# EAGLE design wesleyremote (EAGLE 7.6.0)
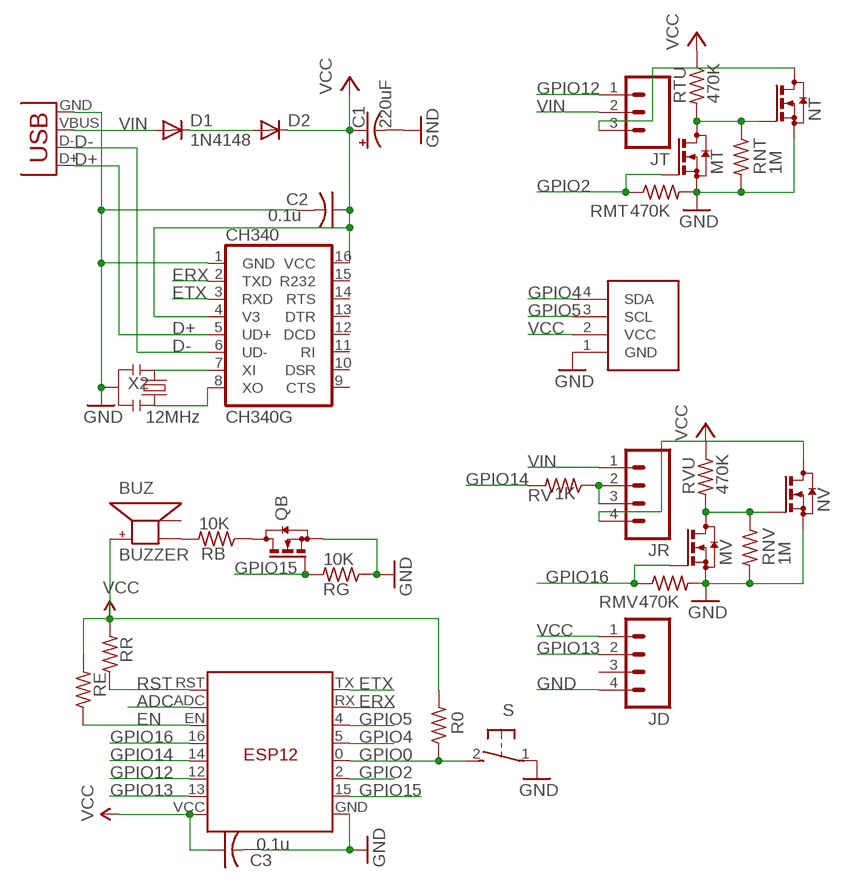
[diagram p0: schematic, sheet 1]

## Parts
BUZ  BUZZER  [SMT-8585-BUZZER]
C1  220uF  CAP_POL3528-KIT  [EIA3528-KIT]
C2  0.1u  C-USC0603K  [C0603K]
C3  0.1u  C-USC0603K  [C0603K]
CH340  CH340G  [SO16]
D1  1N4148  DIODE-MINIMELF  [MINIMELF]
D2  DIODE-MINIMELF  [MINIMELF]
ESP12  ESP12ESPWES  [ESP12_WES]
JD  M04DHT  [1X04_DHT_RFRX]
JR  M04RFRX  [1X04_RFRX]
JT  M03RFTX  [1X03_RFTX]
MT  AO3400  BSS123  [SOT23]
MV  AO3400  BSS123  [SOT23]
NT  AO3400  BSS123  [SOT23]
NV  AO3400  BSS123  [SOT23]
QB  AO3400  BSS123  [SOT23]
R0  R-US_R0603  [R0603]
RB  10K  R-US_R0603  [R0603]
RE  R-US_R0603  [R0603]
RG  10K  R-US_R0603  [R0603]
RMT  470K  R-US_R0603  [R0603]
RMV  470K  R-US_R0603  [R0603]
RNT  1M  R-US_R0603  [R0603]
RNV  1M  R-US_R0603  [R0603]
RR  R-US_R0603  [R0603]
RTU  470K  R-US_R0603  [R0603]
RV  1K  R-US_R0603  [R0603]
RVU  470K  R-US_R0603  [R0603]
S  31-XX  [B3F-31XX]
U$1  SSD1306_OLED_I2C  [SSD1306_OLED_I2C]
X2  12MHz  RESONATORSMD  [RESONATOR-SMD]
X3  USBMICROB2  [USB-MICROB2]

## Nets
ADC: ESP12.ADC
D+: CH340.5(UD+) X3.D+
D-: CH340.6(UD-) X3.D-
EN: ESP12.EN RE.1
ERX: CH340.2(TXD) ESP12.RX
ETX: CH340.3(RXD) ESP12.TX
GND: C1.C(-) C2.2 C3.2 CH340.1(GND) ESP12.GND JD.4 MT.2(S) MV.2(S) NT.2(S) NV.2(S) QB.2(S) RG.1 RMT.2 RMV.2 RNT.2 RNV.2 S.1(P) U$1.1(GND) X2.2 X3.GND
GPIO0: ESP12.0(G0) R0.1 S.2(S)
GPIO2: ESP12.2(G2) MT.1(G) RMT.1
GPIO4: ESP12.5(G5) U$1.4(SDA)
GPIO5: ESP12.4(G4) U$1.3(SCL)
GPIO12: ESP12.12(G12) JT.1
GPIO13: ESP12.13(G13) JD.2
GPIO14: ESP12.14(G14) RV.2
GPIO15: ESP12.15(G15) QB.1(G) RG.2
GPIO16: ESP12.16(G16) MV.1(G) RMV.1
N$1: BUZ.- RB.2
N$2: MV.3(D) NV.1(G) RNV.1 RVU.2
N$3: MT.3(D) NT.1(G) RNT.1 RTU.2
N$4: JT.3 NT.3(D)
N$5: D1.C D2.A
N$6: JR.2 JR.3 RV.1
N$7: JR.4 NV.3(D)
N$8: QB.3(D) RB.1
N$11: CH340.7(XI) X2.1
N$13: CH340.8(XO) X2.3
RST: ESP12.RST RR.1
VCC: BUZ.+ C1.A(+) C2.1 C3.1 CH340.4(V3) CH340.16(VCC) D2.C ESP12.VCC JD.1 R0.2 RE.2 RR.2 RTU.1 RVU.1 U$1.2(VCC)
VIN [power]: D1.A JR.1 JT.2 X3.VBUS
Unconnected: BUZ.A- CH340.9(CTS) CH340.10(DSR) CH340.11(RI) CH340.12(DCD) CH340.13(DTR) CH340.14(RTS) CH340.15(R232) JD.3

## Library data of the parts
BUZ = adafruit:BUZZER
C1 = SparkFunNew:CAP_POL: Capacitor Polarized These are standard SMD and PTH capacitors. Normally 10uF, 47uF, and 100uF in electrolytic and tantalum varieties. Always verify the external diameter of the through hole cap, it varies with capacity, voltage, and manufacturer. The EIA devices should be standard.
C2 C3 = adafruit:C-US: CAPACITOR, American symbol
CH340 = SparkFunNew:CH340
D1 D2 = diode:DIODE-: DIODE
ESP12 = JeeParts:ESP12
JD JR = SparkFun:M04: Header 4 Standard 4-pin 0.1" header. Use with straight break away headers (SKU : PRT-00116), right angle break away headers (PRT-00553), swiss pins (PRT-00743), machine pins (PRT-00117), and female headers (PRT-00115). Molex polarized connector foot print use with SKU : PRT-08231 with associated crimp pins and housings.
JT = SparkFun:M03: Header 3 Standard 3-pin 0.1" header. Use with straight break away headers (SKU : PRT-00116), right angle break away headers (PRT-00553), swiss pins (PRT-00743), machine pins (PRT-00117), and female headers (PRT-00115). Molex polarized connector foot print use with SKU : PRT-08232 with associated crimp pins and housings.
MT MV NT NV QB = transistor-small-signal:BSS123: N-CHANNEL MOS FET
R0 RE RMT RMV RNT RNV RR RTU RV RVU = adafruit:R-US_: RESISTOR, American symbol
RB RG = adafruit2013:R-US_: RESISTOR, American symbol
S = adafruit:31-XX: OMRON SWITCH Now with beefier pads!
U$1 = adafruit2013:SSD1306_OLED_I2C
X2 = SparkFunNew:RESONATOR: Resonator Small SMD resonator. This is the itty bitty 10/20MHz resonators with built in caps. CSTCE10M0G55 and CSTCE20M0V53. Footprint has been reviewed closely but hasn't been tested yet.
X3 = SparkFunNew:USB: USB Connectors USB-B-PTH is fully proven SKU : PRT-00139 USB-miniB is fully proven SKU : PRT-00587 USB-A-PCB is untested. USB-A-H is throughly reviewed, but untested. Spark Fun Electronics SKU : PRT-00437 USB-B-SMT is throughly reviewed, but untested. Needs silkscreen touching up. USB-A-S has not been used/tested USB-MB-H has not been used/tested

## Net classes
0 default: width 0.178 mm, clearance 0.178 mm
1 power: width 0.203 mm, clearance 0.178 mm

## Board
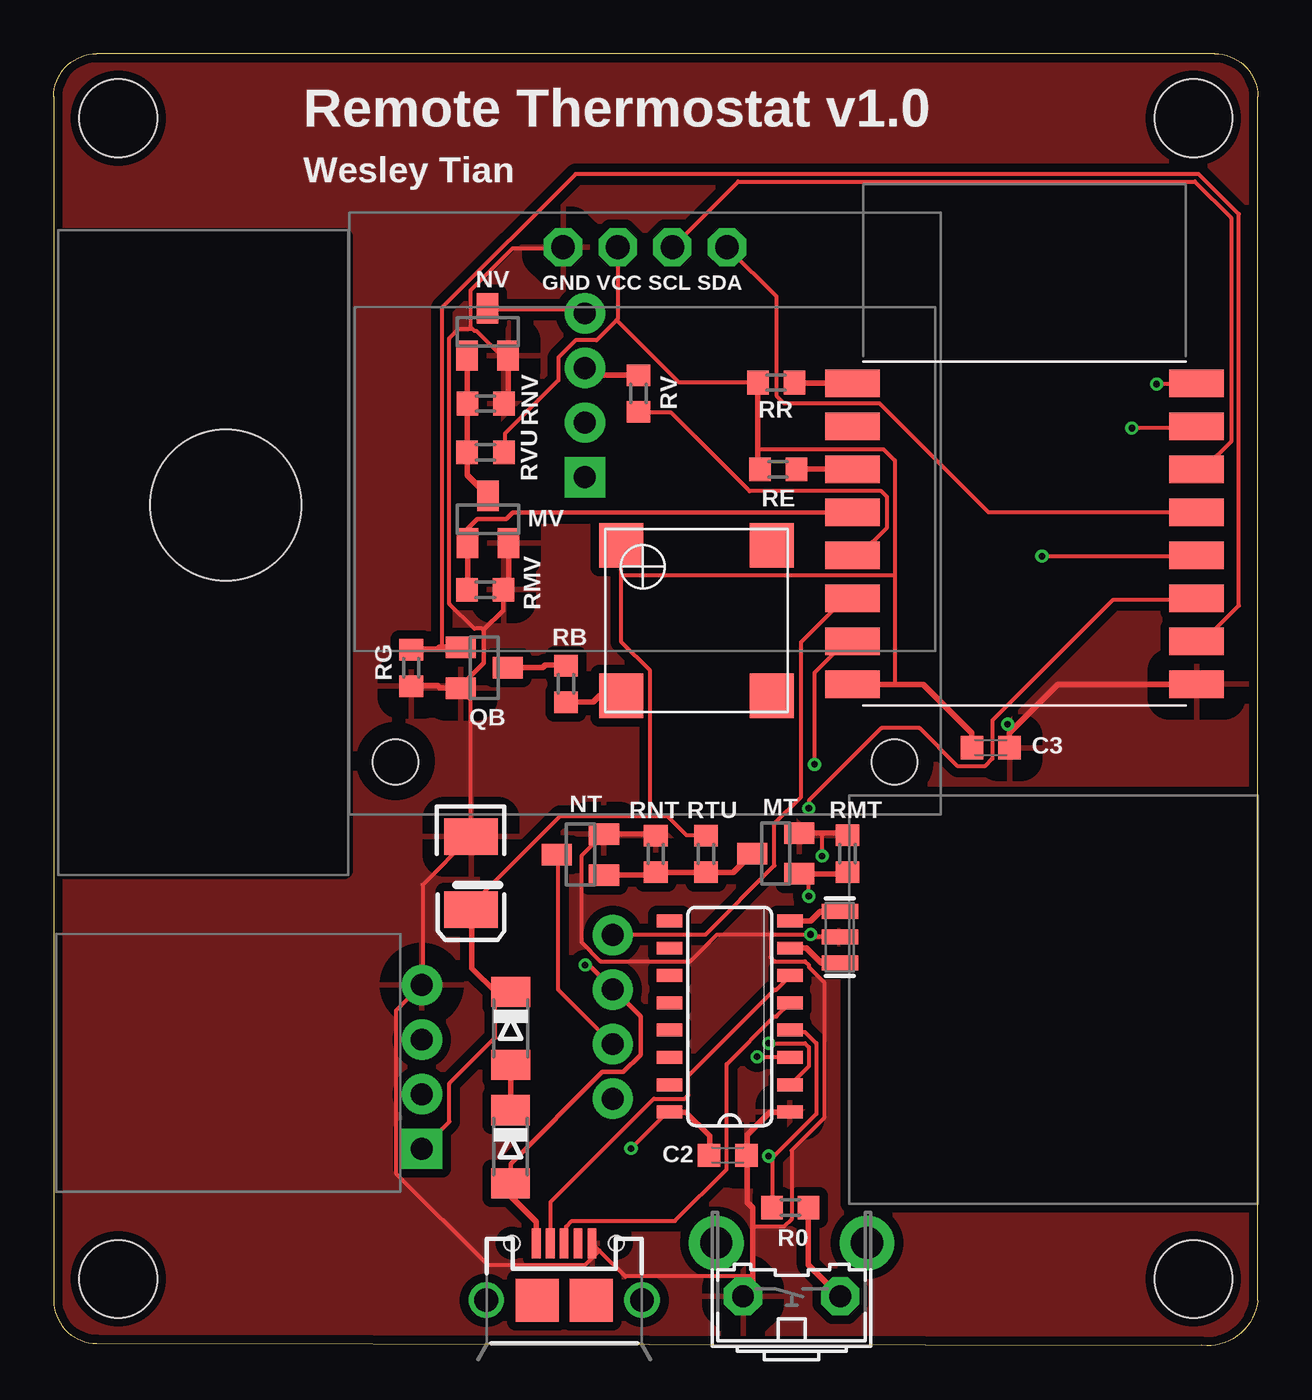
[diagram p1: board, top side]
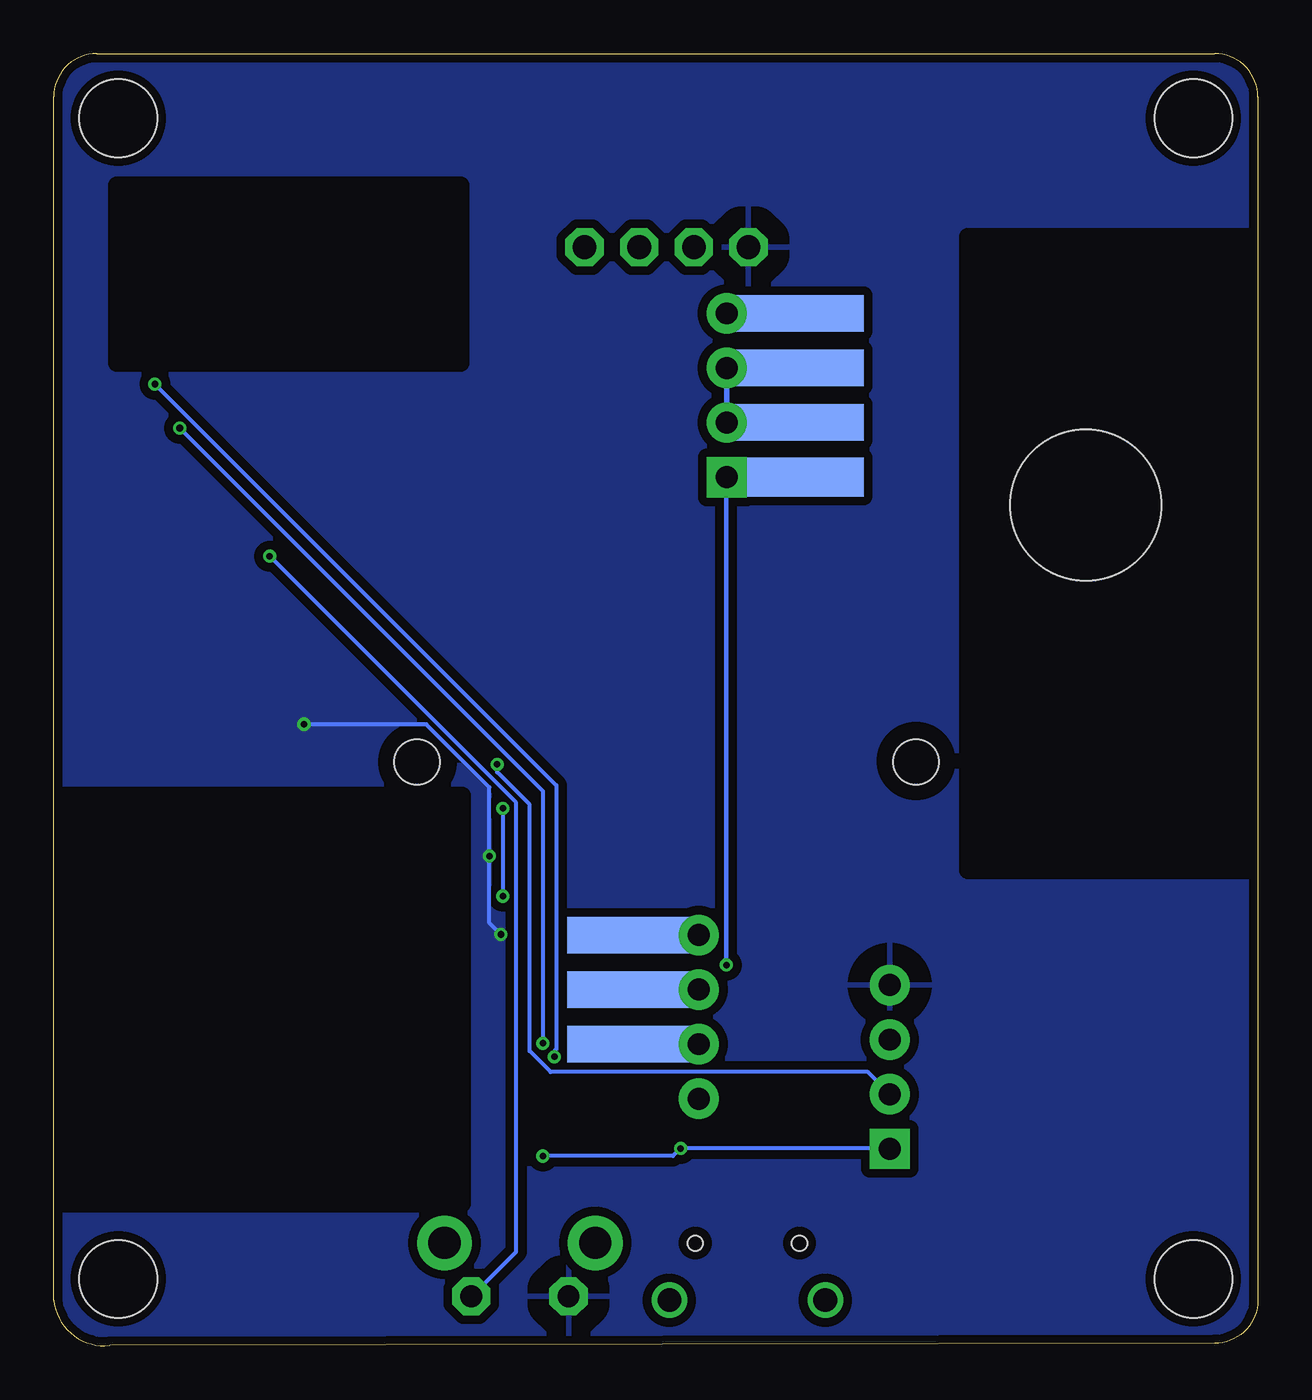
[diagram p2: board, bottom side, seen from below]

Size 56 x 60.11 mm. Coordinates in mm from the lower left corner, seen from the top.
Outline: 0,58.11 0,2.11 arc90 2,0.11 53.4,0.01 arc90 56,2.11 56,58.11 arc90 54,60.11 2,60.11 arc90 0,58.11
Copper layers (1*16): Top 0.035mm / dielectric 1.5mm / Bottom 0.035mm
Design rules "Fusion_eagle_rule_v1.1 *": minimum track width 6mil, minimum drill 12mil, track to track 6mil, track to pad 6mil, pad to pad 6mil, via to via 6mil, smd to smd 0mil, copper to edge 10mil, drill to drill 10mil, minimum pad ring 10mil, minimum via ring 6mil, stop-mask expansion 2mil, vias tented up to drill 100mil, thermal gap 40mil
Holes 3.6 mm at 3,57.11 53,57.11 3,3.11 53,3.11
Holes 7 mm at 8,39.11
tRestrict: area 0.5,22.1 to 13.5,51.6; area 37,6.6 to 56,25.6; area 14.5,25.8 to 17.3,28.6; area 37.7,25.7 to 40.5,28.6; area 37,45.8 to 53.1,54
bRestrict: area 0.5,22.1 to 13.5,51.6; area 37,6.6 to 56,25.6; area 14.5,25.8 to 17.3,28.6; area 37.7,25.7 to 40.5,28.6; area 37.1,45.7 to 53.1,54

### Footprints (pad centres in the part's own frame; a part is rotated, then mirrored left to right if it is on the bottom)
SMT-8585-BUZZER = smd 2.05 x 2.05: + -3.5,-3.5; - 3.5,-3.5; A- 3.5,3.5; NC1 -3.5,3.5
EIA3528-KIT = smd 1.7 x 2.5: A 1.7,0; C -1.7,0
C0603K = smd 1.05 x 1.08: 1 -0.875,0; 2 0.875,0
SO16 = smd 0.6 x 1.2: 1 -4.445,-2.8; 2 -3.175,-2.8; 3 -1.905,-2.8; 4 -0.635,-2.8; 5 0.635,-2.8; 6 1.905,-2.8; 7 3.175,-2.8; 8 4.445,-2.8; 9 4.445,2.8; 10 3.175,2.8; 11 1.905,2.8; 12 0.635,2.8; 13 -0.635,2.8; 14 -1.905,2.8; 15 -3.175,2.8; 16 -4.445,2.8
MINIMELF = smd 1.4 x 1.8: A 1.7,0; C -1.7,0
ESP12_WES = smd 2.54 x 1.27: 0 8,-3.27; 2 8,-5.27; 4 8,0.73; 5 8,-1.27; 12 -8,-5.27; 13 -8,-7.27; 14 -8,-3.27; 15 8,-7.27; 16 -8,-1.27; ADC -8,2.73; EN -8,0.73; GND 8,-9.27; RST -8,4.73; RX 8,2.73; TX 8,4.73; VCC -8,-9.27
1X04_DHT_RFRX = drill 1.016 pad 1.88 square: 1 0,0 | drill 1.016 pad 1.88: 2 2.54,0; 3 5.08,0; 4 7.62,0
1X04_RFRX = drill 1.016 pad 1.88 square: 1 0,0 | drill 1.016 pad 1.88: 2 2.54,0; 3 5.08,0; 4 7.62,0 | smd 1.8 x 6 bottom: P$1 0,3.38 | smd 1.7 x 6 bottom: P$2 2.54,3.38; P$3 5.08,3.38; P$4 7.62,3.38
1X03_RFTX = drill 1.016 pad 1.88: 1 0.5,-12; 2 3.04,-12; 3 5.58,-12; 4 8.12,-12 | smd 1.7 x 6 bottom: P$1 0.5,-8.89; P$2 3.04,-8.89; P$3 5.58,-8.89
SOT23 = smd 1 x 1.4: 1 -0.95,-1.1; 2 0.95,-1.1; 3 0,1.1
R0603 = smd 1 x 1.1: 1 -0.85,0; 2 0.85,0
B3F-31XX = drill 1.016 pad 1.778 octagon: 1 -2.261,-1.245; 2 2.261,-1.245 | drill 1.499 pad 2.54: 3 -3.505,1.245; 4 3.505,1.245
SSD1306_OLED_I2C = drill 1.1 pad 1.778 octagon: 1 -3.81,0; 2 -1.27,0; 3 1.27,0; 4 3.81,0 | hole 2.1: 11.6,-23.95; -11.6,-23.95
RESONATOR-SMD = smd 0.7 x 1.7: 1 -1.2,0; 2 0,0; 3 1.2,0
USB-MICROB2 = smd 0.4 x 1.4: D+ 0,2.65; D- -0.65,2.65; GND 1.3,2.65; ID 0.65,2.65; VBUS -1.3,2.65 | drill 1.1: MT1 -3.625,0; MT2 3.625,0 | smd 2 x 2: MT3 1.25,0; MT4 -1.25,0 | hole 0.7: -2.425,2.65; 2.425,2.65

### Placement (x,y rotation side)
BUZ  29.89,33.74 270 top
C1  19.41,21.99 270 top
C2  31.35,8.86 0 top
C3  43.58,27.82 0 top
CH340  31.44,15.32 90 top
D1  21.24,9.26 270 top
D2  21.25,14.77 270 top
ESP12  45.15,40.05 0 top
JD  17.12,9.16 90 top
JR  24.7,40.41 90 top
JT  38,19.61 270 top
MT  33.58,22.9 90 top
MV  20.2,38.44 0 top
NT  24.49,22.85 90 top
NV  20.18,47.16 0 top
QB  20.02,31.54 270 top
R0  34.26,6.42 180 top
RB  23.82,30.79 270 top
RE  33.69,40.78 180 top
RG  16.63,31.54 90 top
RMT  36.91,22.89 90 top
RMV  20.07,35.17 0 top
RNT  28,22.88 90 top
RNV  20.09,43.83 0 top
RR  33.6,44.81 180 top
RTU  30.34,22.88 270 top
RV  27.2,44.3 270 top
RVU  20.08,41.56 180 top
S  34.32,3.54 0 top
U$1  27.5,51.11 0 top
X2  36.56,19.01 90 top
X3  23.74,2.12 0 top

### Tracks (layer width: path | path; a pad name or v marks a point on that pad's centre or on a via)
D+
  Top 0.178: CH340.5 34.23,15.94 33.6,15.32 33.52,15.32 31.29,13.09 31.29,8.2 28.89,5.8 24.09,5.8 23.82,5.54 23.82,4.83 X3.D+
D-
  Top 0.178: CH340.6 34.23,17.18 33.6,16.56 33.52,16.56 29.52,12.56 29.52,11.67 29.34,11.49 27.91,11.49 23.11,6.69 23.11,4.83 X3.D-
EN
  Top 0.254: ESP12.EN RE.1
ERX  (via drill 0.3)
  Top 0.178: v33.25,14.07 34.94,14.07 35.12,13.89 35.12,13 34.31,12.2 CH340.2 | v50.14,42.7 53.07,42.7 ESP12.RX
  Bottom 0.178: v33.25,14.07 33.25,25.81 v50.14,42.7
ETX  (via drill 0.3)
  Top 0.178: v32.72,13.45 34.23,13.45 CH340.3 | v51.3,44.74 53.07,44.74 ESP12.TX
  Bottom 0.178: v32.72,13.45 32.72,13.72 32.63,13.8 32.63,26.07 v51.3,44.74
GND  (via drill 0.3)
  Top 0.178: 25.38,4.43 26.58,3.22 32.5,3.22 | 25.38,4.43 25.07,4.74 X3.GND | 35.2,19.05 35.03,19.05 34.94,19.14 33.34,19.14 | 35.2,19.05 36.54,19.05 X2.2 | 33.34,19.14 30.85,19.14 29.6,17.89 25.43,17.89 24.54,18.78 24.54,22.78 25.51,23.76 NT.2 | v35.74,22.78 35.74,23.85 | 35.2,19.05 v35.2,19.14 | 32.5,5.54 33.96,5.54 34.31,5.89 34.31,9.09 35.83,10.6 35.83,16.92 35.12,17.63 35.12,17.72 34.94,17.89 33.52,17.89 33.34,18.07 33.34,19.14 | v44.36,28.92 44.61,28.67 | 19.43,47.36 19.38,47.41 19.38,49.1 21.34,51.05 23.65,51.05 U$1.1 | 19.43,47.36 19.56,47.23 19.65,47.23 20.71,46.16 21.07,46.16 NV.2 | QB.2 18.94,30.52 19.38,30.07 19.38,23.76 C1.C 19.38,23.67 17.16,21.45 17.16,16.83 JD.4 17.07,16.74 15.91,15.58 15.91,8.03 20.18,3.76 24.71,3.76 25.38,4.43 | 19.43,47.36 19.38,47.32 18.85,47.32 18.4,46.87 18.4,34.52 19.56,33.36 19.91,33.36 20,33.31
  Top 0.203: QB.2 18.95,30.71 20,31.76 20,33.31 20.9,34.21 20.9,35.06 RMV.2
  Top 0.254: NV.2 21.13,44.02 RNV.2 | MV.2 21.15,35.4 RMV.2 | RG.1 16.65,30.71 17.85,30.71 17.95,30.61 18.9,30.61 QB.2 | S.1 32.1,2.31 32.5,2.71 32.5,3.22 32.5,5.54 32.5,6.41 32.25,6.66 32.25,8.86 C2.2 32.25,8.96 32.25,9.81 33.3,10.86 34.2,10.86 CH340.1 | NT.2 27.93,23.8 RNT.2 | MT.2 35.74,23.85 36.8,23.85 RMT.2 | ESP12.GND 53.15,30.76 46.7,30.76 44.61,28.67 44.45,28.51 44.45,27.86 C3.2
  Bottom 0.178: v35.2,19.14 35.74,19.67 v35.74,22.78 35.74,25.98 38.67,28.92 v44.36,28.92
  pour Top (isolate 0.406): 0,60.11 56,60.11 56,0.11 0,0.11
  pour Bottom (isolate 0.406): 0,60.11 56,60.11 56,0.11 0,0.11
GPIO0  (via drill 0.3)
  Top 0.178: v45.96,36.74 53.07,36.74 ESP12.0
  Top 0.254: R0.1 35.1,3.76 36.55,2.31 S.2
  Bottom 0.178: v45.96,36.74 34.49,25.27 34.49,4.38 36.54,2.34 S.2
GPIO2  (via drill 0.3)
  Top 0.178: v35.12,20.92 35.12,21.89 MT.1 | v35.12,25.01 35.12,25.36 38.49,28.74 40.27,28.74 42.05,26.96 43.29,26.96 43.65,27.32 43.65,29.09 49.25,34.7 53.07,34.7 ESP12.2
  Top 0.254: MT.1 36.82,21.95 RMT.1
  Bottom 0.178: v35.12,25.01 v35.12,20.92
GPIO4
  Top 0.178: ESP12.5 53.07,38.79 43.47,38.79 38.41,43.85 33.96,43.85 33.6,44.21 33.6,48.83 31.38,51.05 U$1.4
GPIO5
  Top 0.178: ESP12.4 53.16,40.83 53.52,40.83 54.76,42.07 54.76,52.48 53.07,54.16 31.83,54.16 28.8,51.14 U$1.3
GPIO12
  Top 0.178: ESP12.12 37.07,34.7 36.72,34.7 34.76,32.74 34.76,25.54 33.52,24.29 33.52,22.34 30.32,19.14 26.05,19.14 JT.1
GPIO13  (via drill 0.3)
  Top 0.178: v35.38,27.05 35.38,31.32 36.8,32.74 37.07,32.74 ESP12.13
  Bottom 0.178: v35.38,27.05 35.38,26.69 33.87,25.18 33.87,13.72 32.89,12.74 18.14,12.74 17.16,11.76 JD.2
GPIO14
  Top 0.178: RV.2 27.2,43.41 28.71,43.41 32.36,39.76 38.49,39.76 38.76,39.5 38.76,38.07 37.52,36.83 37.16,36.83 ESP12.14
GPIO15
  Top 0.178: 17.95,32.51 18.05,32.56 18.05,48.3 24.27,54.52 53.25,54.52 55.12,52.65 55.12,34.43 53.52,32.83 53.16,32.83 ESP12.15
  Top 0.254: RG.2 16.65,32.41 17.85,32.41 17.95,32.51 18.9,32.51 QB.1
GPIO16
  Top 0.203: MV.1 19.25,38.01 19.7,38.46 21.05,38.46 21.35,38.76 37.15,38.76 ESP12.16
  Top 0.254: MV.1 19.25,35.2 RMV.1
N$1
  Top 0.254: RB.2 23.85,29.96 25.1,29.96 25.4,30.26 26.35,30.26 BUZ.-
N$2
  Top 0.254: NV.1 RNV.1 RVU.2 19.23,40.51 MV.3
N$3
  Top 0.254: NT.1 27.87,21.9 RNT.1 RTU.2 31.61,22.03 MT.3
N$4
  Top 0.178: NT.3 23.47,22.78 23.47,16.56 25.96,14.07 JT.3
N$5
  Top 0.254: D1.C 21.25,13.01 21.2,13.06 21.25,13.11 D2.A
N$6
  Top 0.254: RV.1 25.04,45.15 JR.3
  Bottom 0.254: JR.3 JR.2
N$7
  Top 0.178: NV.3 20.18,48.21 24.54,48.21 24.62,48.12 JR.4
N$8
  Top 0.254: QB.3 21.15,31.56 22.75,31.56 22.85,31.66 23.8,31.66 RB.1
N$11
  Top 0.254: X2.1 35.7,17.81 35,18.51 CH340.7
N$13
  Top 0.254: X2.3 35.65,20.21 35.2,19.76 CH340.8
RST
  Top 0.254: ESP12.RST 34.48,44.78 RR.1
VCC  (via drill 0.3)
  Top 0.178: 26.18,47.72 26.23,47.76 26.23,51.05 U$1.2 | 26.18,47.72 25.25,46.79 24.27,46.79 23.47,45.99 23.47,44.92 20.98,42.43 20.98,41.63 RVU.1 | 26.18,47.72 29.07,44.83 32.63,44.83 RR.2 | 39.12,35.85 39.12,41.19 38.58,41.72 32.75,41.72 | 39.12,35.85 39.12,30.76 | 27.74,24.65 23.56,24.65 19.47,20.56 19.47,20.38 C1.A | 27.74,24.65 28.54,24.65 29.43,23.76 30.32,23.76 RTU.1 | 26.4,35.85 26.4,32.74 27.74,31.41 27.74,24.65 | 26.4,35.85 26.4,37.18 BUZ.+ | 33.47,8.78 35.47,10.78 35.47,14.07 34.94,14.6 34.31,14.6 CH340.4 | 33.47,8.78 33.43,8.74 33.43,6.43 R0.2 | v26.85,9.18 28.54,10.87 CH340.16 | v33.25,8.83 33.43,8.83 33.47,8.78 | D2.C 20.54,16.38 20.54,14.34 18.4,12.2 18.4,10.43 17.16,9.18 JD.1 | 26.4,35.85 39.12,35.85
  Top 0.254: RR.2 32.75,41.72 32.75,40.87 RE.2 | C1.A 19.45,20.26 19.45,17.56 20.55,16.46 D2.C | CH340.16 28.65,10.86 29.4,10.86 30.5,9.76 30.5,8.86 C2.1 | ESP12.VCC 37.15,30.76 39.12,30.76 40.45,30.76 42.7,28.51 42.7,27.86 C3.1
  Bottom 0.178: JD.1 17.16,9.18 v26.85,9.18 27.2,8.83 v33.25,8.83
VIN  (via drill 0.3)
  Top 0.203: D1.A 21.25,7.67 21.25,8.47 25.51,12.74 26.49,12.74 27.29,13.54 27.29,15.32 26.05,16.56 JT.2 25.96,16.65 24.89,17.72 v24.71,17.72
  Top 0.254: D1.A 21.25,6.96 22.45,5.76 22.45,4.81 X3.VBUS
  Bottom 0.203: v24.71,17.72 24.71,40.39 JR.1

### Text on the board
tNames: Remote Thermostat v1.0 | Wesley Tian